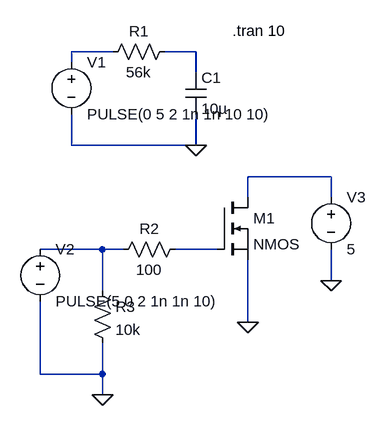
[diagram p0: schematic Draft1.asc]
Draft1.asc, the LTspice schematic file:
Version 4
SHEET 1 880 784
WIRE 144 240 80 240
WIRE 272 240 224 240
WIRE 80 256 80 240
WIRE 272 272 272 240
WIRE 80 384 80 336
WIRE 272 384 272 336
WIRE 272 384 80 384
WIRE 480 432 352 432
WIRE 352 464 352 432
WIRE 480 464 480 432
WIRE 128 544 32 544
WIRE 160 544 128 544
WIRE 304 544 240 544
WIRE 480 592 480 544
WIRE 128 608 128 544
WIRE 352 656 352 560
WIRE 32 736 32 624
WIRE 128 736 128 688
WIRE 128 736 32 736
WIRE 128 768 128 736
FLAG 272 384 0
FLAG 128 768 0
FLAG 352 656 0
FLAG 480 592 0
SYMBOL voltage 80 240 R0
SYMATTR InstName V1
SYMATTR Value PULSE(0 5 2 1n 1n 10 10)
SYMBOL Res 240 224 R90
WINDOW 0 0 56 VBottom 2
WINDOW 3 32 56 VTop 2
SYMATTR InstName R1
SYMATTR Value 56k
SYMBOL Cap 256 272 R0
SYMATTR InstName C1
SYMATTR Value 10µ
SYMBOL voltage 32 528 R0
SYMATTR InstName V2
SYMATTR Value PULSE(5 0 2 1n 1n 10)
SYMBOL Res 256 528 R90
WINDOW 0 0 56 VBottom 2
WINDOW 3 32 56 VTop 2
SYMATTR InstName R2
SYMATTR Value 100
SYMBOL Res 112 592 R0
SYMATTR InstName R3
SYMATTR Value 10k
SYMBOL nmos 304 464 R0
SYMATTR InstName M1
SYMBOL Voltage 480 448 R0
SYMATTR InstName V3
SYMATTR Value 5
TEXT 328 208 Left 2 !.tran 10

The netlist it stands for:
* Draft1.asc
V1 N001 0 PULSE(0 5 2 1n 1n 10 10)
R1 N002 N001 56k
C1 N002 0 10µ
V2 N004 0 PULSE(5 0 2 1n 1n 10)
R2 N005 N004 100
R3 N004 0 10k
M1 N003 N005 0 0 NMOS
V3 N003 0 5
.model NMOS NMOS
.model PMOS PMOS
.lib standard.mos
.tran 10
.backanno
.end